# EAGLE design Sensor board v5 (EAGLE 9.7.0)
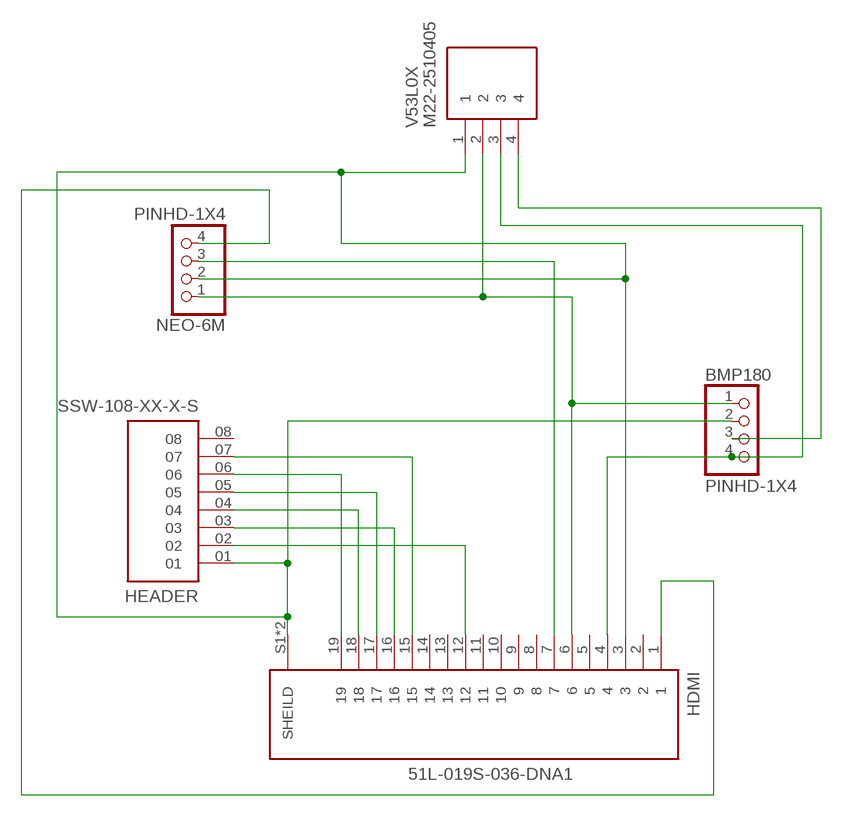
[diagram p0: schematic, sheet 1]

## Parts
BMP180  PINHD-1X4  [1X04]
HDMI  51L-019S-036-DNA1  [VALCON_51L-019S-036-DNA1]
HEADER  SSW-108-XX-X-S  [SAMTEC_SSW-108-XX-X-S]
NEO-6M  PINHD-1X4  [1X04]
V53L0X  M22-2510405  [HDRV4W50P0X200_1X4_800X200X525]

## Nets
3V3: HDMI.15 HEADER.07
5V: BMP180.1 HDMI.6 NEO-6M.1 V53L0X.2
CE0: HDMI.18 HEADER.04
CE1: HDMI.12 HEADER.02
GND: BMP180.2 HDMI.3 HDMI.S1(SHEILD) HDMI.S2(SHEILD) HEADER.01 NEO-6M.2 V53L0X.1
MISO: HDMI.17 HEADER.05
MOSI: HDMI.19 HEADER.06
RX: HDMI.7 NEO-6M.3
SCL: BMP180.3 V53L0X.4
SCLK: HDMI.16 HEADER.03
SDA: BMP180.4 HDMI.4 V53L0X.3
TX: HDMI.1 NEO-6M.4
Unconnected: HDMI.2 HDMI.5 HDMI.8 HDMI.9 HDMI.10 HDMI.11 HDMI.13 HDMI.14 HEADER.08

## Library data of the parts
BMP180 NEO-6M = Connector:PINHD-1X4: PIN HEADER; CATEGORY: CONNECTOR; SUB-CATEGORY: PIN-HEADER
HDMI = 51L-019S-036-DNA1:51L-019S-036-DNA1: 51L - Valcon Through Hole PCB Mount HDMI Type Sockets; MANUFACTURER: Valcon; MAXIMUM_PACKAGE_HEIGHT: 15.4mm; PARTREV: 27 Apr, 2021; STANDARD: Manufacturer recommendations
HEADER = SSW-108-XX-X-S:SSW-108-XX-X-S: Conn Socket Strip SKT 8 POS 2.54mm Solder ST Top Entry Thru-Hole Tube; MANUFACTURER: Samtec; PARTREV: A; STANDARD: Manufacturer Recommendations
V53L0X = M22-2510405:M22-2510405: 2.00mm (0.079") Pitch SIL Vertical 2.4mm Throughboard Pin Header, 3.5mm mating pin height, gold, 4 contacts Source: Datasheet <https://cdn.harwin.com/pdfs/M22-251.pdf>; DESCRIPTION: 2.00mm (0.079") Pitch SIL Vertical 2.4mm Throughboard Pin Header, 3.5mm mating pin height, gold, 4 contacts; HEIGHT: 5.25mm; MANUFACTURER_NAME: Harwin; MANUFACTURER_PART_NUMBER: M22-2510405; MOUSER_PART_NUMBER: 855-M22-2510405; MOUSER_PRICE-STOCK: https://www.mouser.co.uk/ProductDetail/Harwin/M22-2510405?qs=vF78I%252BjhbY9z7PsFZBZ5CA%3D%3D

## Board
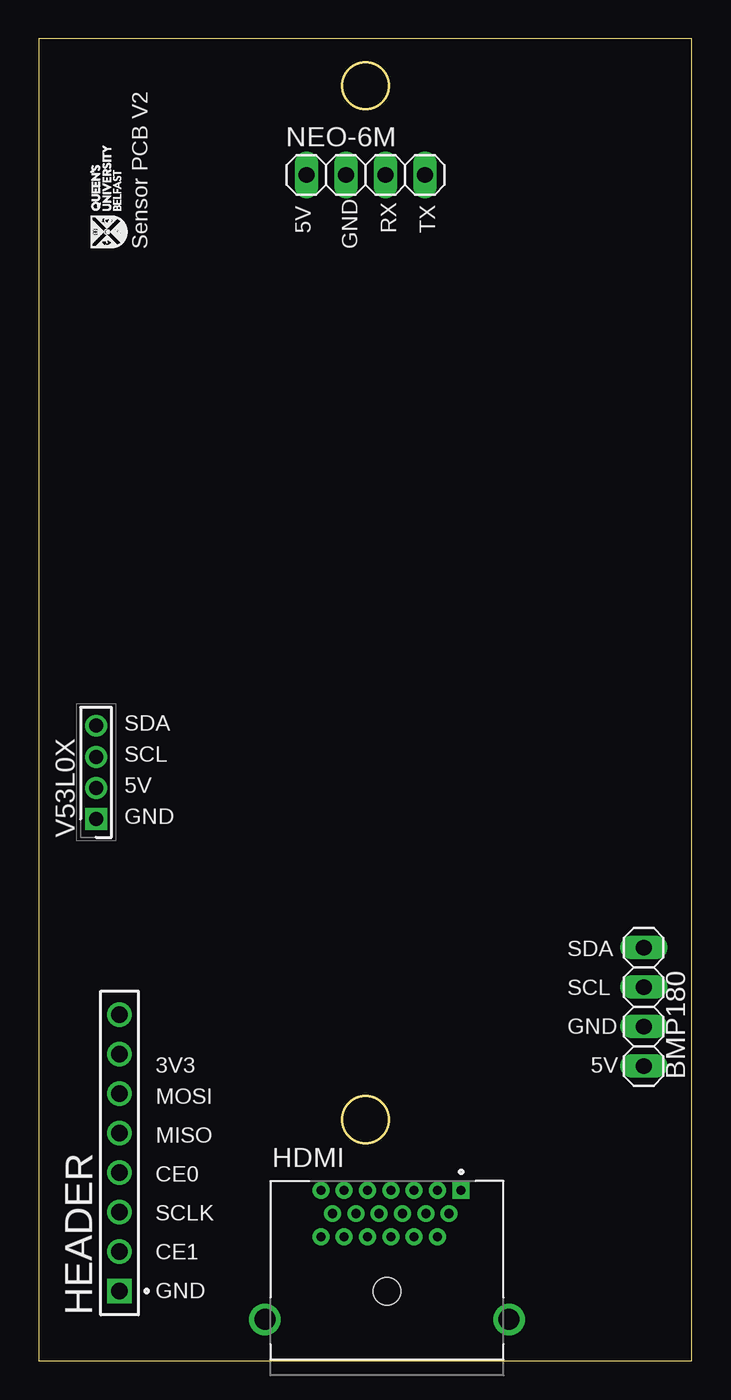
[diagram p1: board, top side]
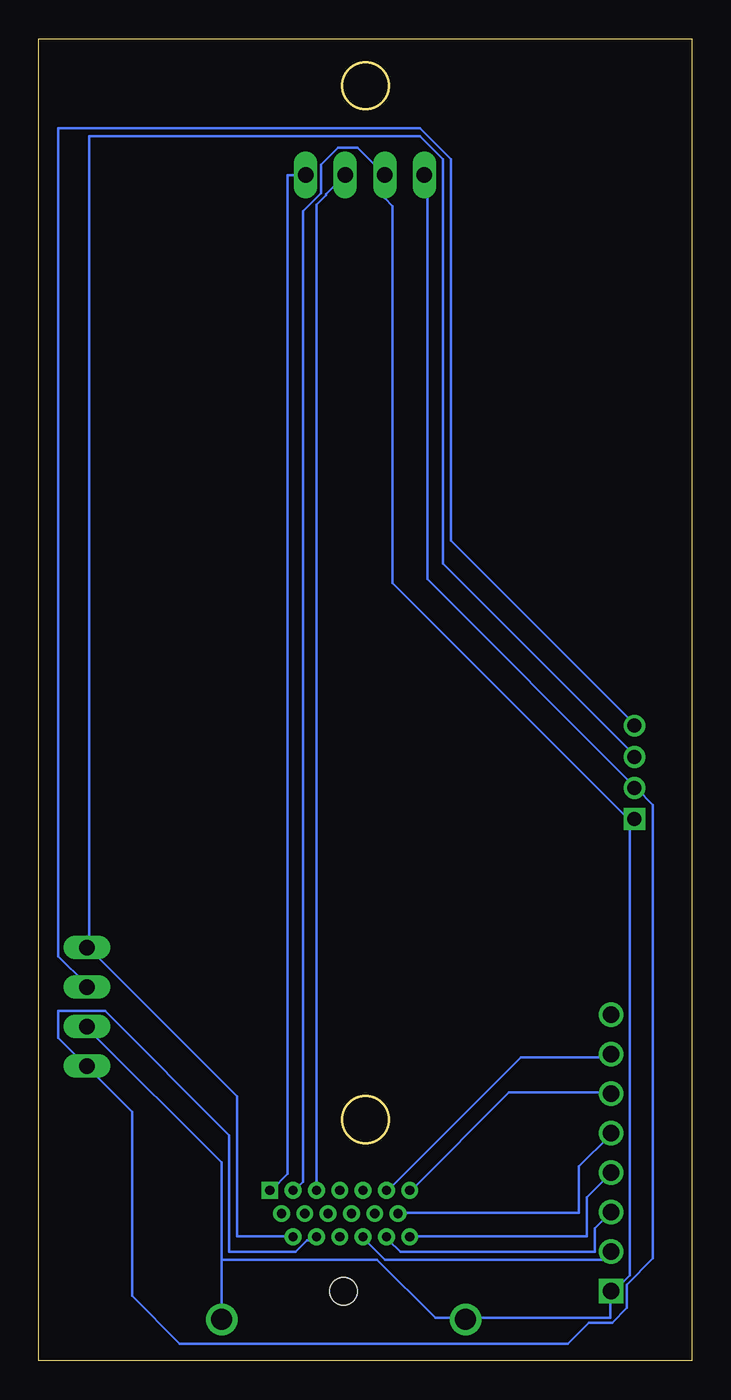
[diagram p2: board, bottom side, seen from below]

Size 42 x 85 mm. Coordinates in mm from the lower left corner, seen from the top.
Outline: 0,0 42,0 42,85 0,85 0,0
Copper layers (1*16): Top / Bottom
Stack-up Default Layer Stack: Top User Defined 0.035mm / Dielectric-1 User Defined 1.5mm / Bottom User Defined 0.035mm
Design rules "default": minimum track width 6mil, minimum drill 0.35mm, track to track 6mil, track to pad 6mil, pad to pad 6mil, via to via 6mil, smd to smd 6mil, copper to edge 40mil, drill to drill 6mil, minimum pad ring 10mil, minimum via ring 8mil, stop-mask expansion 4mil, vias tented up to drill 0mil, thermal gap 10mil
Milling: area 19.5,80.5 to 22.5,83.5; area 19.5,14 to 22.5,17

### Footprints (pad centres in the part's own frame; a part is rotated, then mirrored left to right if it is on the bottom)
1X04 = drill 1.016 long: 1 -3.81,0; 2 -1.27,0; 3 1.27,0; 4 3.81,0
VALCON_51L-019S-036-DNA1 = drill 0.58 square: 1 4.75,5.65 | drill 0.58: 2 4,4.15; 3 3.25,5.65; 4 3.25,2.65; 5 2.5,4.15; 6 1.75,2.65; 7 1.75,5.65; 8 1,4.15; 9 0.25,5.65; 10 0.25,2.65; 11 -0.5,4.15; 12 -1.25,2.65; 13 -1.25,5.65; 14 -2,4.15; 15 -2.75,5.65; 16 -2.75,2.65; 17 -3.5,4.15; 18 -4.25,2.65; 19 -4.25,5.65 | drill 1.35: S1 -7.85,-2.65; S2 7.85,-2.65 | hole 1.75: 0,-0.85
SAMTEC_SSW-108-XX-X-S = drill 1.04 square: 01 -8.89,0 | drill 1.04: 02 -6.35,0; 03 -3.81,0; 04 -1.27,0; 05 1.27,0; 06 3.81,0; 07 6.35,0; 08 8.89,0
HDRV4W50P0X200_1X4_800X200X525 = drill 0.9 pad 1.35 square: 1 0,0 | drill 0.9 pad 1.35: 2 2,0; 3 4,0; 4 6,0

### Placement (x,y rotation side)
BMP180  38.91,22.75 90 top
HDMI  22.39,5.31 0 top
HEADER  5.19,13.36 90 top
NEO-6M  21.02,76.25 0 top
V53L0X  3.68,34.83 90 top

### Tracks (layer width: path | path; a pad name or v marks a point on that pad's centre or on a via)
3V3
  Bottom 0.152: HDMI.15 19.5,11 11,19.5 5.25,19.5 HEADER.07
5V
  Bottom 0.152: HDMI.6 24.25,7.75 24.75,7.75 25.5,7 29.75,7 29.75,14.5 37.75,22.5 40.75,22.5 40.75,20.75 39,19 BMP180.1 38.75,18.75 36,16 36,4.16 32.93,1.09 7.98,1.09 6.62,2.44 5.12,2.44 4.18,3.39 4.18,4.89 2.5,6.57 2.5,35.75 3.5,36.75 V53L0X.2 3.75,37 17,50.25 17,76.25 NEO-6M.1
CE0
  Bottom 0.152: HDMI.18 18,8 6.75,8 6.75,10.5 5.25,12 HEADER.04
CE1
  Bottom 0.152: HDMI.12 21,7.75 19.75,6.5 5.25,6.5 5.25,7 HEADER.02
GND
  Bottom 0.152: 30.25,6.5 30.25,2.75 HDMI.S2 | 30.25,6.5 30.25,12.75 38.75,21.25 BMP180.2 | 30.25,6.5 20.25,6.5 16.5,2.75 14.75,2.75 HDMI.S1 14.5,2.75 5.25,2.75 5.25,4.25 HEADER.01 5,4.5 4,5.5 4,34.5 3.75,34.75 V53L0X.1 4.08,34.83 19.25,50 19.25,74.25 19.75,74.75 NEO-6M.2 21.5,78 22.75,78 23.84,76.91 23.84,75.08 25,73.92 25,11.5 25.5,11 HDMI.3
MISO
  Bottom 0.152: HDMI.17 18.75,9.5 7.25,9.5 7.25,12.5 5.25,14.5 HEADER.05
MOSI
  Bottom 0.152: HDMI.19 18,11 11.75,17.25 5.25,17.25 HEADER.06
RX
  Bottom 0.152: NEO-6M.3 23.54,75 23.54,74.95 24.14,74.34 HDMI.7
SCL
  Bottom 0.152: V53L0X.4 3.75,41 15.5,52.75 15.5,77.25 17.5,79.25 40.75,79.25 40.75,26 39,24.25 BMP180.3
SCLK
  Bottom 0.152: HDMI.16 19.5,7.75 18.75,7 6.25,7 6.25,8.5 5.25,9.5 HEADER.03
SDA
  Bottom 0.152: HDMI.4 25.75,8 29.25,8 29.25,17 38.75,26.5 BMP180.4 38.75,26.75 38.75,78.75 17.5,78.75 16,77.25 16,51.25 3.75,39 V53L0X.3
TX
  Bottom 0.152: HDMI.1 27,11 26,12 26,76.25 NEO-6M.4

### Text on the board
tNames: Sensor PCB V2 | 5V | GND | RX | TX | SDA | SCL | 5V | GND | SDA | SCL | GND | 3V3 | 5V | MOSI | MISO | CE0 | SCLK | CE1 | GND